# EAGLE design POGO_DCDC (EAGLE 9.6.2)
COMPANY: ADAFRUIT INDUSTRIES; DRAWN: KTOWN; REV: B
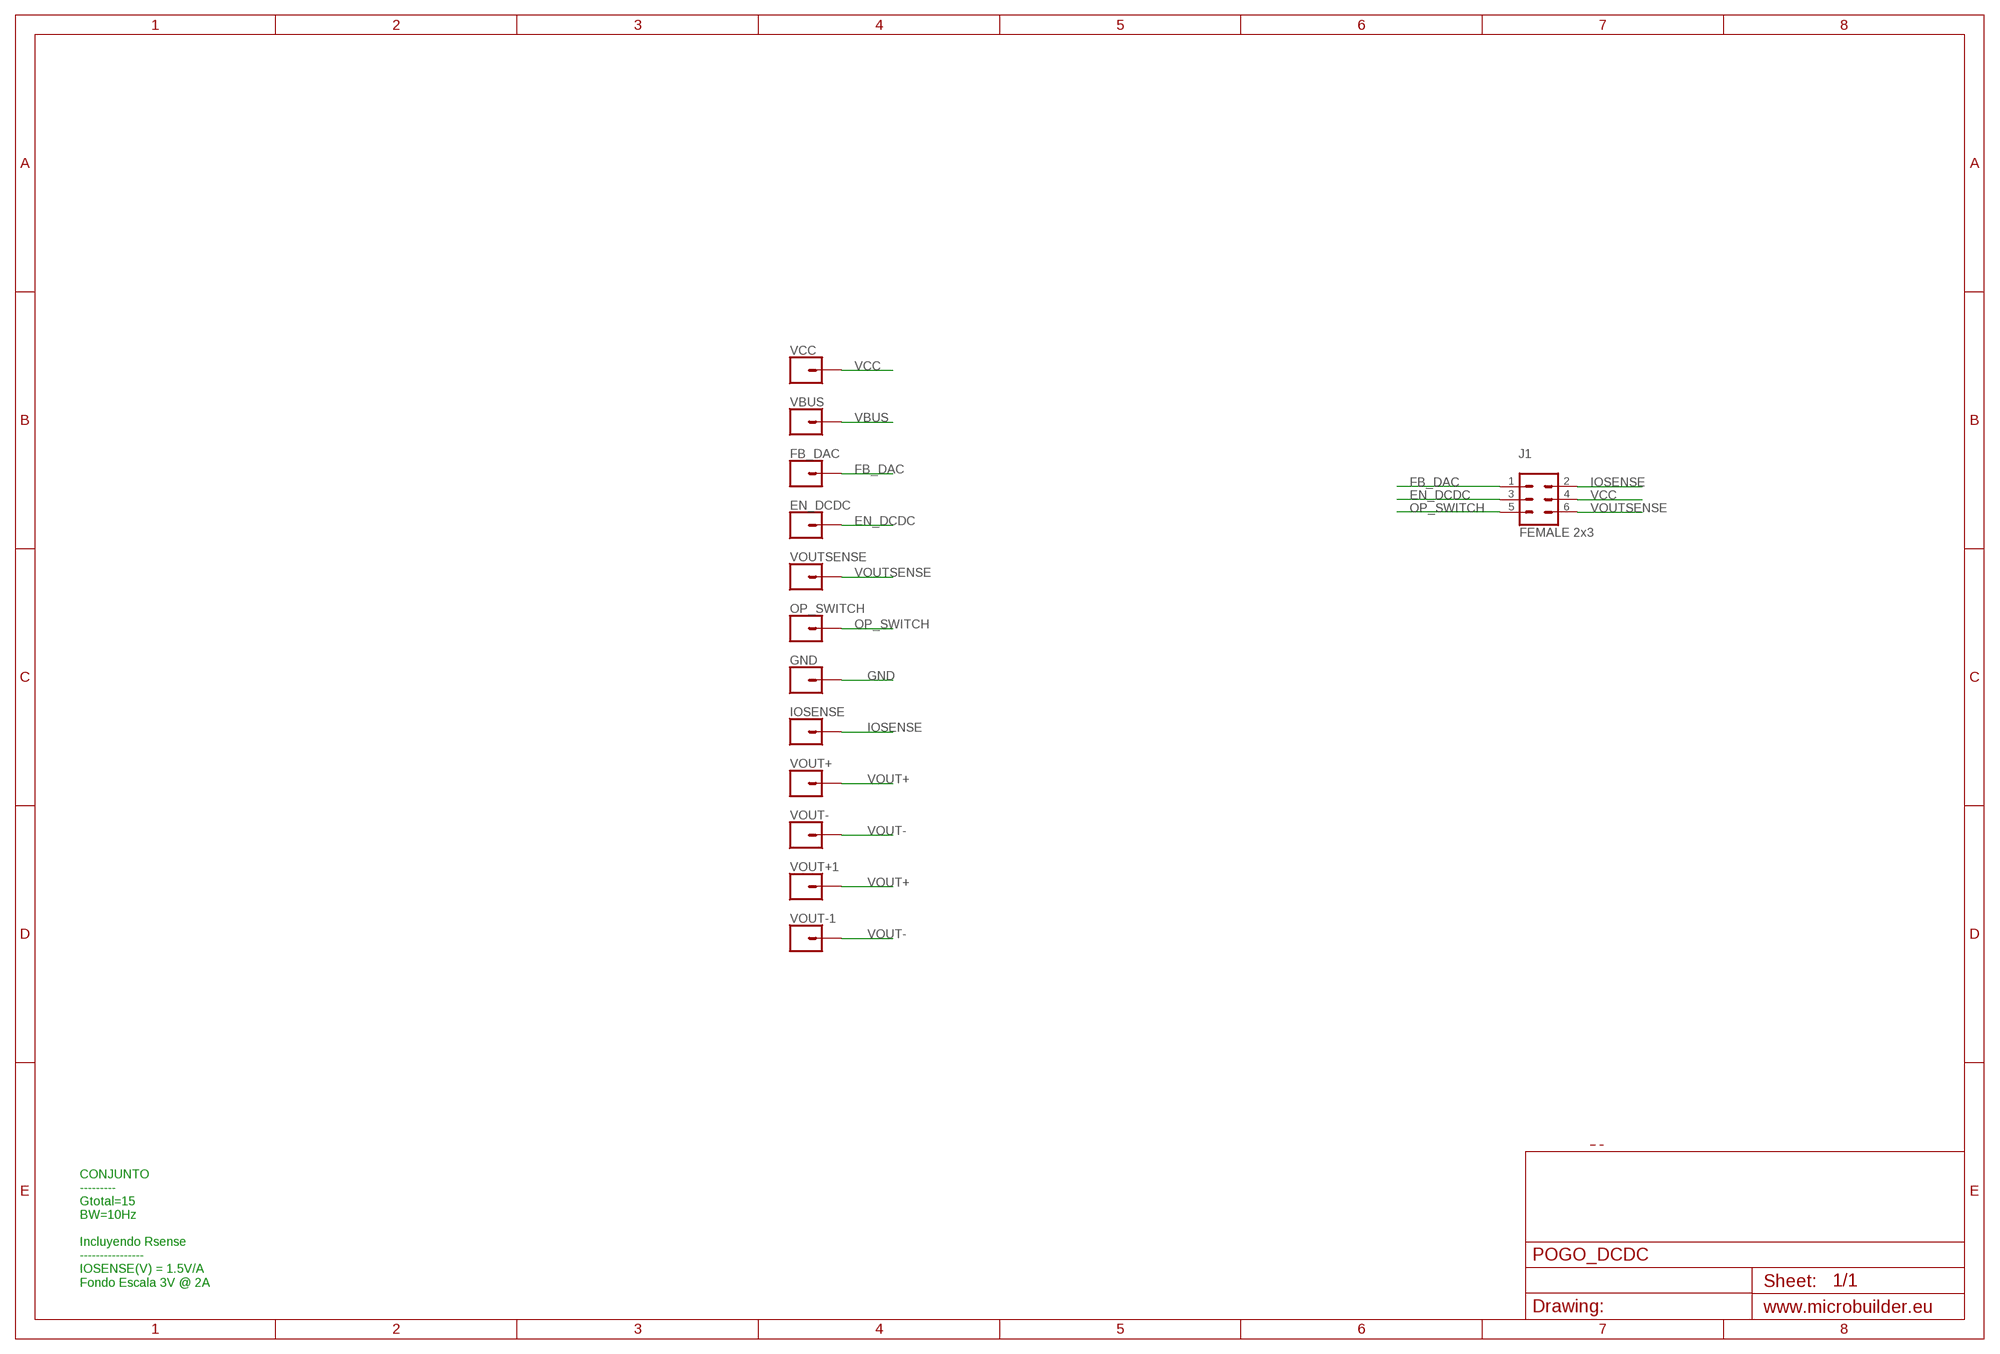
[diagram p0: schematic, sheet 1]

## Parts
EN_DCDC  CONN_01POGOPIN_HOLE_LARGE  [1X01_POGOPIN_HOLE_0.061_DIA]
FB_DAC  CONN_01POGOPIN_HOLE_LARGE  [1X01_POGOPIN_HOLE_0.061_DIA]
GND  CONN_01POGOPIN_HOLE_LARGE  [1X01_POGOPIN_HOLE_0.061_DIA]
IOSENSE  CONN_01POGOPIN_HOLE_LARGE  [1X01_POGOPIN_HOLE_0.061_DIA]
J1  FEMALE 2x3  CONN_03X2FEMALE  [2X3]
OP_SWITCH  CONN_01POGOPIN_HOLE_LARGE  [1X01_POGOPIN_HOLE_0.061_DIA]
VBUS  CONN_01POGOPIN_HOLE_LARGE  [1X01_POGOPIN_HOLE_0.061_DIA]
VCC  CONN_01POGOPIN_HOLE_LARGE  [1X01_POGOPIN_HOLE_0.061_DIA]
VOUT+  CONN_01POGOPIN_HOLE_LARGE  [1X01_POGOPIN_HOLE_0.061_DIA]
VOUT+1  CONN_01POGOPIN_HOLE_LARGE  [1X01_POGOPIN_HOLE_0.061_DIA]
VOUT-  CONN_01POGOPIN_HOLE_LARGE  [1X01_POGOPIN_HOLE_0.061_DIA]
VOUT-1  CONN_01POGOPIN_HOLE_LARGE  [1X01_POGOPIN_HOLE_0.061_DIA]
VOUTSENSE  CONN_01POGOPIN_HOLE_LARGE  [1X01_POGOPIN_HOLE_0.061_DIA]

## Nets
EN_DCDC: EN_DCDC.2 J1.3
FB_DAC: FB_DAC.2 J1.1
GND: GND.2
IOSENSE: IOSENSE.2 J1.2
OP_SWITCH: J1.5 OP_SWITCH.2
VBUS: VBUS.2
VCC: J1.4 VCC.2
VOUT+: VOUT+1.2 VOUT+.2
VOUT-: VOUT-1.2 VOUT-.2
VOUTSENSE: J1.6 VOUTSENSE.2

## Notes on the sheet
- CONJUNTO
  ---------
  Gtotal=15
  BW=10Hz
  
  Incluyendo Rsense
  ----------------
  IOSENSE(V) = 1.5V/A
  Fondo Escala 3V @ 2A

## Library data of the parts
EN_DCDC FB_DAC GND IOSENSE OP_SWITCH VBUS VCC VOUT+ VOUT+1 VOUT- VOUT-1 VOUTSENSE = SparkFun-Connectors:CONN_01: Single connection point. Often used as Generic Header-pin footprint for 0.1 inch spaced/style header connections On any of the 0.1 inch spaced packages, you can populate with these: Break Away Headers - Straight <https://www.sparkfun.com/products/116> (PRT-00116) Break Away Male Headers - Right Angle <https://www.sparkfun.com/products/553> (PRT-00553) Female Headers <https://www.sparkfun.com/products/115> (PRT-00115) Break Away Headers - Machine Pin <https://www.sparkfun.com/products/117> (PRT-00117) Break Away Female Headers - Swiss Machine Pin <https://www.sparkfun.com/products/743> (PRT-00743) This device is also useful as a general connection point to wire up your design to another part of your project. Our various solder wires solder well into these plated through hole pads. Hook-Up Wire - Assortment (Stranded, 22 AWG) <https://www.sparkfun.com/products/11375> (PRT-11375) Hook-Up Wire - Assortment (Solid Core, 22 AWG) <https://www.sparkfun.com/products/11367> (PRT-11367) View the entire wire category on our website here <https://www.sparkfun.com/categories/141> Special notes: SMTSO-256-ET is a "flush mount" nut for a 4-40 screw. We mostly use this on specialty testbeds; it is a nice way to connect hardware to your PCB at an adjustable hieght. Also note, the SNAP packages are for using a snappable style connector. We sell a baggie of snaps and they are also used on two LilyPad designs: Snap Assortment - 30 pack (male and female) <https://www.sparkfun.com/products/11347> (DEV-11347) LilyPad Arduino SimpleSnap <https://www.sparkfun.com/products/10941> (DEV-10941) LilyPad SimpleSnap Protoboard <https://www.sparkfun.com/products/10940> (DEV-10940)
J1 = SparkFun-Connectors:CONN_03X2: Multi connection point. Often used as Generic Header-pin footprint for 0.1 inch spaced/style header connections You can populate with any combo of single row headers, but if you'd like an exact match, check these: Header - 2x3 (Male, 0.1") <https://www.sparkfun.com/products/12807> (PRT-12807) Header - 2x3 (Female, 0.1") <https://www.sparkfun.com/products/13010> (PRT-13010) 2x3 Pin Shrouded Header <https://www.sparkfun.com/products/10877> (PRT-10877) On any of the 0.1 inch spaced packages, you can populate with these: Break Away Headers - Straight <https://www.sparkfun.com/products/116> (PRT-00116) Break Away Male Headers - Right Angle <https://www.sparkfun.com/products/553> (PRT-00553) Female Headers <https://www.sparkfun.com/products/115> (PRT-00115) Break Away Headers - Machine Pin <https://www.sparkfun.com/products/117> (PRT-00117) Break Away Female Headers - Swiss Machine Pin <https://www.sparkfun.com/products/743> (PRT-00743) Special note: the shrouded connector mates well with our 3x2 ribbon cables: Ribbon Crimp Connector - 6-pin (2x3, Female) <https://www.sparkfun.com/products/10651> (PRT-10651) Ribbon Cable - 6 wire (15ft) <https://www.sparkfun.com/products/10646> (PRT-10646); PROD_ID: CONN-11566

## Net classes
2 gnd: width 0.305 mm, drill 0.483 mm, clearance 0.203 mm

## Board
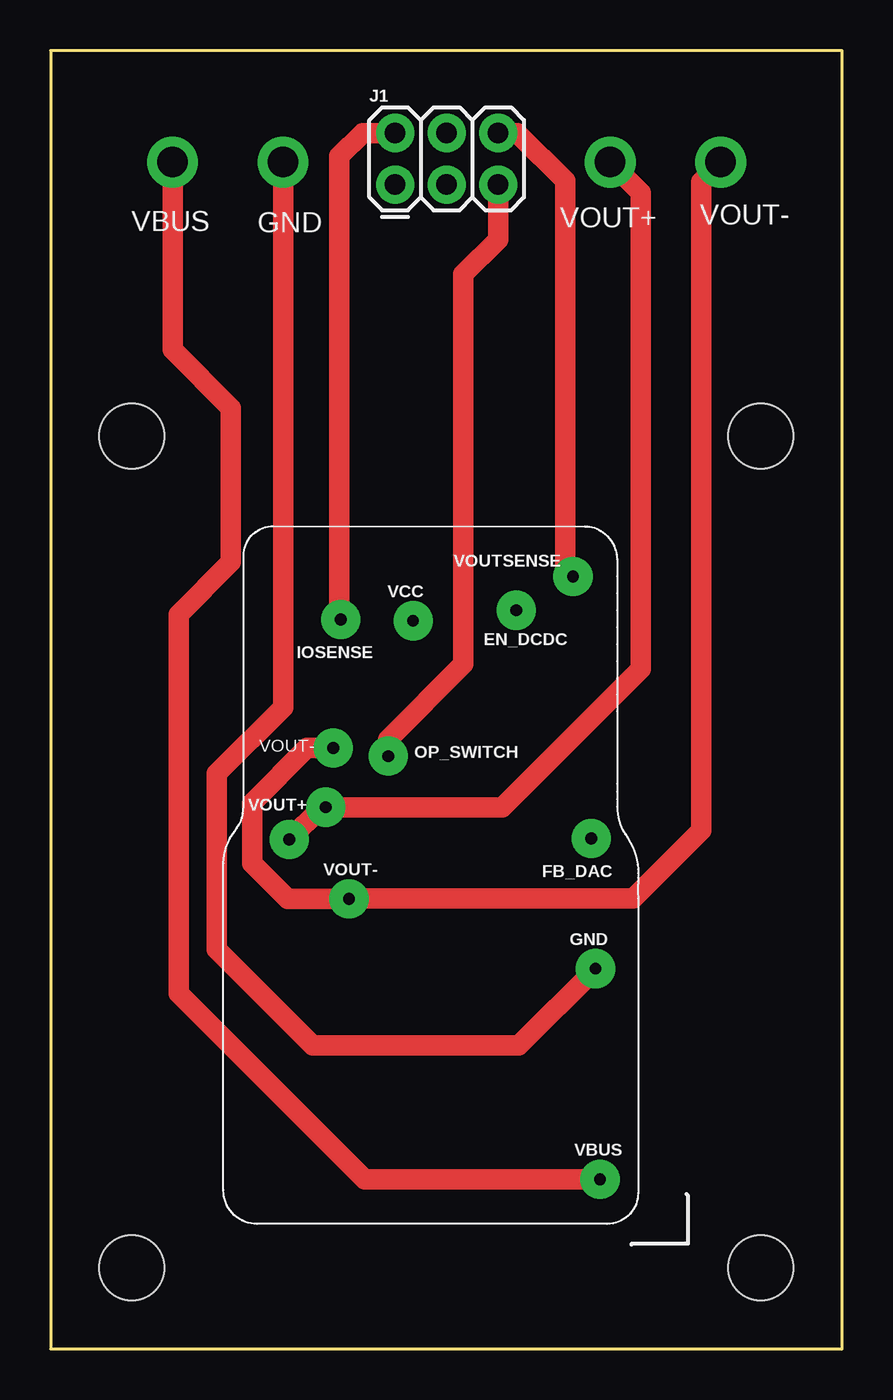
[diagram p1: board, top side]
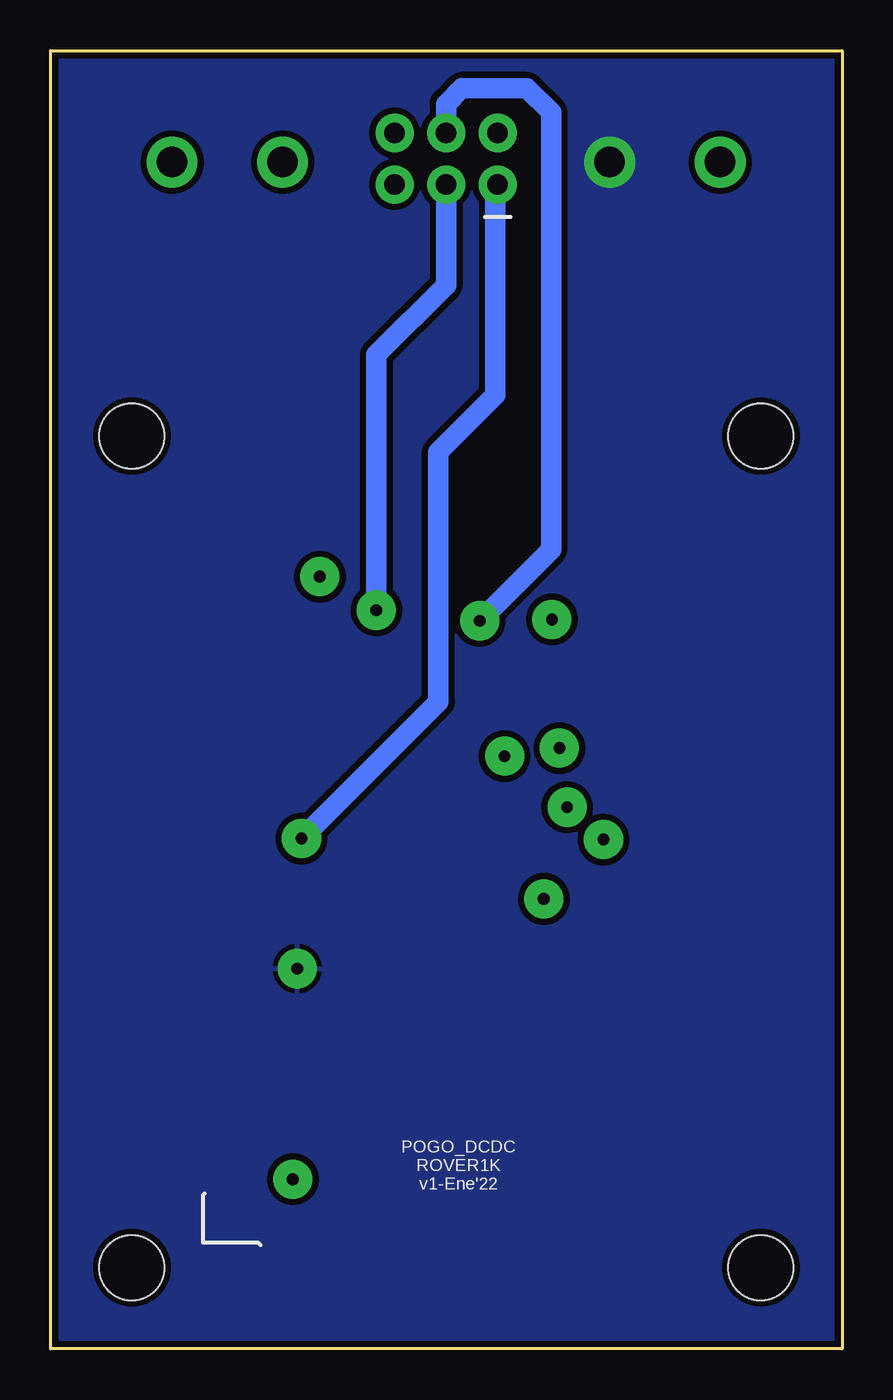
[diagram p2: board, bottom side, seen from below]

Size 39 x 64 mm. Coordinates in mm from the lower left corner, seen from the top.
Outline: 0,64 0,0 39,0 39,64 0,64
Copper layers (1*16): Top 0.035mm / dielectric 1.5mm / Bottom 0.035mm
Design rules "adafruit *": minimum track width 0.15mm, minimum drill 0.25mm, track to track 8mil, track to pad 8mil, pad to pad 8mil, via to via 8mil, smd to smd 5mil, copper to edge 8mil, drill to drill 8mil, minimum pad ring 10mil, minimum via ring 8mil, stop-mask expansion 2mil, vias tented up to drill 20mil, thermal gap 10mil
Holes 3.2 mm at 35,4 4,4 4,45 35,45

### Footprints (pad centres in the part's own frame; a part is rotated, then mirrored left to right if it is on the bottom)
1X01_POGOPIN_HOLE_0.061_DIA = drill 0.58 pad 1.93: 2 0,0
2X3 = drill 1.016 pad 1.88: 1 0,0; 2 0,2.54; 3 2.54,0; 4 2.54,2.54; 5 5.08,0; 6 5.08,2.54

### Placement (x,y rotation side)
EN_DCDC  22.95,36.41 0 top
FB_DAC  26.64,25.16 0 top
GND  26.85,18.74 0 top
IOSENSE  14.3,35.96 0 top
J1  16.97,57.4 0 top
OP_SWITCH  16.63,29.22 0 top
VBUS  27.07,8.36 0 top
VCC  17.86,35.89 0 top
VOUT+  13.55,26.7 0 top
VOUT+1  11.76,25.11 0 top
VOUT-  14.7,22.18 0 top
VOUT-1  13.93,29.62 0 top
VOUTSENSE  25.74,38.07 0 top

### Tracks (layer width: path | path; a pad name or v marks a point on that pad's centre or on a via)
EN_DCDC
  Bottom 1.016: J1.3 19.51,52.45 22.95,49.02 EN_DCDC.2
FB_DAC
  Bottom 1.016: FB_DAC.2 19.9,31.9 19.9,44.21 17.08,47.03 17.08,57.29 J1.1
GND  (via drill 1.5 pad 2.5)
  Top 1.016: v11.45,58.51 11.45,31.62 8.19,28.36 8.19,19.68 12.91,14.96 23.07,14.96 GND.2
  pour Bottom (isolate 0.305): -1.24,65.34 -1.24,-1.11 1.32,-3.67 38.86,-3.67 42.94,0.41 42.94,61.98 38.95,65.97 -0.6,65.97 -1.23,65.34
IOSENSE
  Top 1.016: IOSENSE.2 14.22,36.04 14.22,58.79 15.37,59.94 J1.2
OP_SWITCH
  Top 1.016: J1.5 22.05,54.68 20.34,52.97 20.34,33.76 16.63,30.05 OP_SWITCH.2
VBUS  (via drill 1.5 pad 2.5)
  Top 1.016: v6.01,58.51 6.01,49.26 8.88,46.38 8.88,38.78 6.31,36.21 6.31,17.52 15.47,8.36 VBUS.2
VCC
  Bottom 1.016: VCC.2 14.34,39.41 14.34,60.96 15.53,62.15 18.73,62.15 19.51,61.37 J1.4
VOUT+  (via drill 1.5 pad 2.5)
  Top 1.016: VOUT+1.2 13.35,26.7 VOUT+.2 22.26,26.7 29.08,33.52 29.08,57 v27.57,58.51
VOUT-  (via drill 1.5 pad 2.5)
  Top 1.016: v33.02,58.51 32.06,57.55 32.06,25.55 28.71,22.2 14.72,22.2 VOUT-.2 11.67,22.18 9.92,23.93 9.92,26.92 12.62,29.62 VOUT-1.2
VOUTSENSE
  Top 1.016: VOUTSENSE.2 25.35,38.46 25.35,57.59 23,59.94 J1.6

### Text on the board
tNames: VBUS | GND | VOUT+ | VOUT- | VOUT-
bNames: POGO_DCDC / ROVER1K / v1-Ene'22